# Altium schematic sheet 02-RCB_Header.SchDoc
size B; SheetNumber: 2; SheetTotal: 12
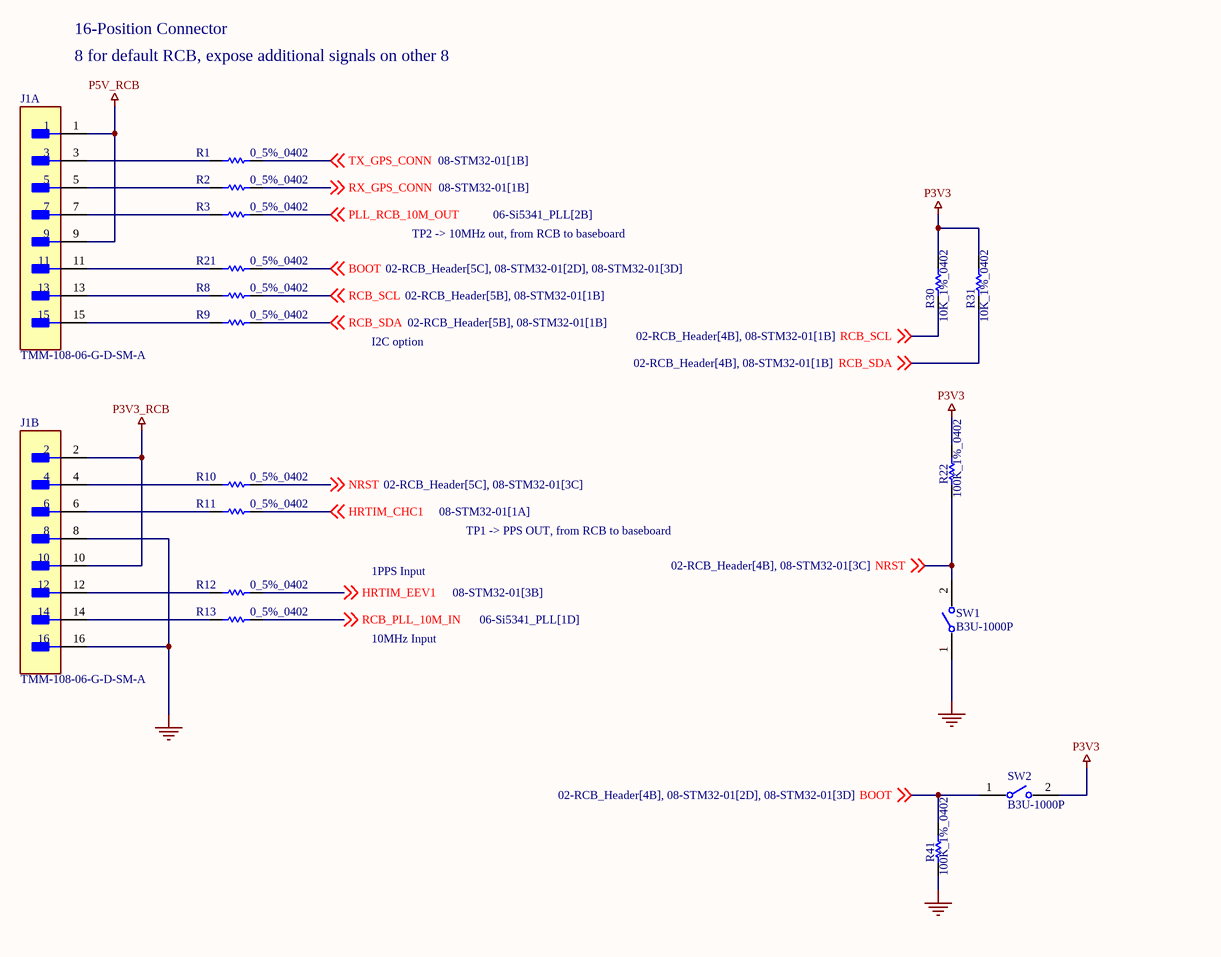
[diagram p0: 02-RCB_Header.SchDoc]

## Parts
J1  TMM-108-06-G-D-SM-A  [FP-TMM-108-06-G-D-SM-A-MFG]  (parts A,B of 2)
R1  0_5%_0402  [RESC1005X40X25NL05T10]
R2  0_5%_0402  [RESC1005X40X25NL05T10]
R3  0_5%_0402  [RESC1005X40X25NL05T10]
R8  0_5%_0402  [RESC1005X40X25NL05T10]
R9  0_5%_0402  [RESC1005X40X25NL05T10]
R10  0_5%_0402  [RESC1005X40X25NL05T10]
R11  0_5%_0402  [RESC1005X40X25NL05T10]
R12  0_5%_0402  [RESC1005X40X25NL05T10]
R13  0_5%_0402  [RESC1005X40X25NL05T10]
R21  0_5%_0402  [RESC1005X40X25NL05T10]
R22  100K_1%_0402  [RESC1005X40X25ML05T10]
R30  10K_1%_0402  [RESC1005X40X25NL10T10]
R31  10K_1%_0402  [RESC1005X40X25NL10T10]
R41  100K_1%_0402  [RESC1005X40X25ML05T10]
SW1  B3U-1000P  [FP-B3U-1000P-MFG]
SW2  B3U-1000P  [FP-B3U-1000P-MFG]

## Nets
GND: J1.8 J1.16 R41.1 SW1.1
P3V3: R22.2 R30.2 R31.2 SW2.2
P3V3_RCB: J1.2 J1.10
P5V_RCB: J1.1 J1.9
BOOT: R21.2 R41.2 SW2.1 ; off-sheet BOOT
HRTIM_CHC1: R11.2 ; off-sheet HRTIM_CHC1
HRTIM_EEV1: R12.2 ; off-sheet HRTIM_EEV1
NRST: R10.2 R22.1 SW1.2 ; off-sheet NRST
PLL_RCB_10M_OUT: R3.2 ; off-sheet PLL_RCB_10M_OUT
RCB_PLL_10M_IN: R13.2 ; off-sheet RCB_PLL_10M_IN
RCB_SCL: R8.2 R30.1 ; off-sheet RCB_SCL
RCB_SDA: R9.2 R31.1 ; off-sheet RCB_SDA
RX_GPS_CONN: R2.2 ; off-sheet RX_GPS_CONN
TX_GPS_CONN: R1.2 ; off-sheet TX_GPS_CONN
NetJ1_3: J1.3 R1.1
NetJ1_4: J1.4 R10.1
NetJ1_5: J1.5 R2.1
NetJ1_6: J1.6 R11.1
NetJ1_7: J1.7 R3.1
NetJ1_11: J1.11 R21.1
NetJ1_12: J1.12 R12.1
NetJ1_13: J1.13 R8.1
NetJ1_14: J1.14 R13.1
NetJ1_15: J1.15 R9.1

## Notes on the sheet
- 16-Position Connector
- 8 for default RCB, expose additional signals on other 8
- TP2 -> 10MHz out, from RCB to baseboard
- I2C option
- TP1 -> PPS OUT, from RCB to baseboard
- 1PPS Input
- 10MHz Input

## Library data of the parts
J1 = CMP-02766-001527-1: CONN HEADER SMD 16POS 2MM; Max Voltage Rating (AC): 500V; Gender: Male; Number of Contacts: 16; Max Current Rating: 3.9A; RoHS Compliant: Yes; Contact Material: Bronze; Number of Rows: 2; Packaging: Bulk; Length: 16mm; Termination: Solder; Depth: 3.94mm; Max Operating Temperature: 125°C; Housing Color: Black; Radiation Hardening: No; Pitch: 2mm; Orientation: Straight; Contact Plating: Gold; Min Operating Temperature: -55°C; Housing Material: Polymer
R1-R3 R8-R13 R21 = CMP-2002-06457-1: Manufacturer: Panasonic; Part Number: ERJ-U020R00X
R22 R41 = CMP-2002-07852-1: Manufacturer: Yageo; Part Number: RC0402FR-13100KL
R30 R31 = CMP-2002-04694-1: Manufacturer: Bourns; Part Number: CR0402-FX-1002GLF
SW1 SW2 = CMP-2100-03586-2: SWITCH TACTILE SPST-NO 0.05A 12V; Contact Resistance: 100mR; Operating Force: 1.5N; Max Current Rating: 50mA; Switch Travel: 0.15mm; Actuator Type: Standard; Mechanical Life: 200000Cycles; Ratings: Dust Proof; Illumination Type: Non-Illuminated; Throw Configuration: SPST; Actuator Length: 0.4mm; Switch Function: Off-Mom; Height: 1.2mm; Width: 3mm; Weight: 0.000776oz; Contact Material: Silver; Max Voltage Rating (DC): 12V; Insulation Resistance: 100MR; Lead Free: Lead Free; Current Rating: 50mA; Termination: SMD/SMT; Length: 4mm; Voltage Rating (DC): 12V; Contact Current Rating: 50mA; Orientation: Straight; Depth: 2.5mm; Max Operating Temperature: 70°C; Packaging: Tape and Reel; Min Operating Temperature: -25°C; Package Quantity: 1; Mount: Surface Mount; Electrical Life: 200000Cycles